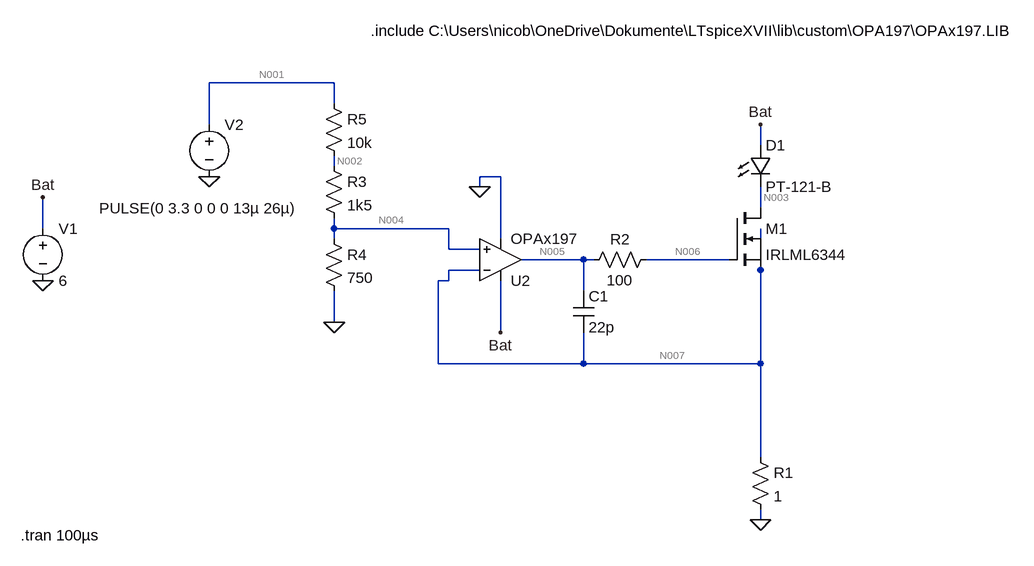
[diagram p0: schematic IR-Led-Driver_26.02.2026.asc]
IR-Led-Driver_26.02.2026.asc, the LTspice schematic file:
Version 4
SHEET 1 1440 680
WIRE 272 -128 80 -128
WIRE 272 -96 272 -128
WIRE 80 -64 80 -128
WIRE 928 -32 928 -64
WIRE 272 0 272 -16
WIRE 528 16 496 16
WIRE 496 32 496 16
WIRE 928 64 928 32
WIRE -176 96 -176 48
WIRE 272 96 272 80
WIRE 448 96 272 96
WIRE 272 112 272 96
WIRE 528 112 528 16
WIRE 448 128 448 96
WIRE 496 128 448 128
WIRE 656 144 560 144
WIRE 672 144 656 144
WIRE 880 144 752 144
WIRE 496 160 448 160
WIRE 928 160 928 96
WIRE 448 176 448 160
WIRE 448 176 432 176
WIRE 656 192 656 144
WIRE 272 240 272 192
WIRE 528 256 528 176
WIRE 432 304 432 176
WIRE 656 304 656 256
WIRE 656 304 432 304
WIRE 928 304 928 160
WIRE 928 304 656 304
WIRE 928 448 928 304
WIRE 928 544 928 528
FLAG -176 48 Bat
FLAG -176 176 0
FLAG 528 256 Bat
FLAG 496 32 0
FLAG 928 544 0
FLAG 80 16 0
FLAG 928 -64 Bat
FLAG 272 240 0
SYMBOL voltage -176 80 R0
WINDOW 123 0 0 Left 0
WINDOW 39 0 0 Left 0
SYMATTR InstName V1
SYMATTR Value 6
SYMBOL res 912 432 R0
SYMATTR InstName R1
SYMATTR Value 1
SYMBOL nmos 880 64 R0
SYMATTR InstName M1
SYMATTR Value IRLML6344
SYMBOL voltage 80 -80 R0
WINDOW 3 -169 145 Left 2
WINDOW 123 0 0 Left 0
WINDOW 39 0 0 Left 0
SYMATTR InstName V2
SYMATTR Value PULSE(0 3.3 0 0 0 13µ 26µ)
SYMBOL LED 912 -32 R0
SYMATTR InstName D1
SYMATTR Value PT-121-B
SYMBOL res 768 128 R90
WINDOW 0 0 56 VBottom 2
WINDOW 3 32 56 VTop 2
SYMATTR InstName R2
SYMATTR Value 100
SYMBOL cap 640 192 R0
SYMATTR InstName C1
SYMATTR Value 22p
SYMBOL OpAmps\\opamp2 528 208 M180
SYMATTR InstName U2
SYMATTR Value OPAx197
SYMBOL res 256 -16 R0
SYMATTR InstName R3
SYMATTR Value 1k5
SYMBOL res 256 96 R0
SYMATTR InstName R4
SYMATTR Value 750
SYMBOL res 256 -112 R0
SYMATTR InstName R5
SYMATTR Value 10k
TEXT 328 -208 Left 2 !.include C:\\Users\\nicob\\OneDrive\\Dokumente\\LTspiceXVII\\lib\\custom\\OPA197\\OPAx197.LIB
TEXT -210 568 Left 2 !.tran 100µs

The netlist it stands for:
* IR-Led-Driver_26.02.2026.asc
V1 Bat 0 6
R1 N007 0 1
M1 N003 N006 N007 N007 IRLML6344
V2 N001 0 PULSE(0 3.3 0 0 0 13µ 26µ)
D1 Bat N003 PT-121-B
R2 N006 N005 100
C1 N005 N007 22p
XU2 N004 N007 Bat 0 N005 OPAx197  ; pins In+ In- V+ V- OUT
R3 N002 N004 1k5
R4 N004 0 750
R5 N001 N002 10k
.model D D
.lib standard.dio
.model NMOS NMOS
.model PMOS PMOS
.lib standard.mos
.include C:\Users\nicob\OneDrive\Dokumente\LTspiceXVII\lib\custom\OPA197\OPAx197.LIB
.tran 100µs
.backanno
.end

* Results of the author's LTspice run, read from the files saved beside the schematic
* Operating Point, zero values left out:
*   V(bat) = 6 V
*   V(n007) = 18.52 µV
*   V(n003) = 5.183 V
*   V(n006) = 504.1 mV
*   V(n005) = 504.1 mV
*   V(n004) = 6.995 nV
*   V(n002) = 6.083 nV
*   Id(M1) = 18.52 µA
*   Is(M1) = -18.52 µA
*   I(D1) = 18.52 µA
*   I(R4) = 9.327 pA
*   I(R1) = 18.52 µA
*   I(V1) = -1.019 mA
*   Ix(u2:IN+) = -9.935 pA
*   Ix(u2:IN-) = -12.06 pA
*   Ix(u2:VCC) = 1 mA
*   Ix(u2:VEE) = -1 mA
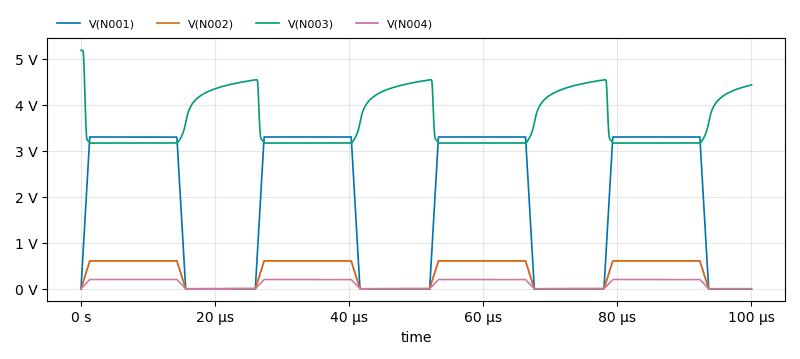
[diagram p1: Transient Analysis of IR-Led-Driver_26.02.2026.asc, plotted from the saved traces]
* Transient Analysis, 1 run:
*   V(N001): min 0 V, max 3.3 V, average 1.888 V, rms 2.458 V, last 0 V
*   V(N002): min -90.77 µV, max 606.3 mV, average 346.7 mV, rms 451.4 mV, last 0 V
*   V(N003): min 3.164 V, max 5.183 V, average 3.641 V, rms 3.686 V, last 4.433 V
*   V(N004): min -104.4 µV, max 202.2 mV, average 115.6 mV, rms 150.5 mV, last 0 V